# Altium project forwardConverterPCB.PrjPcb (part 17 of 22)
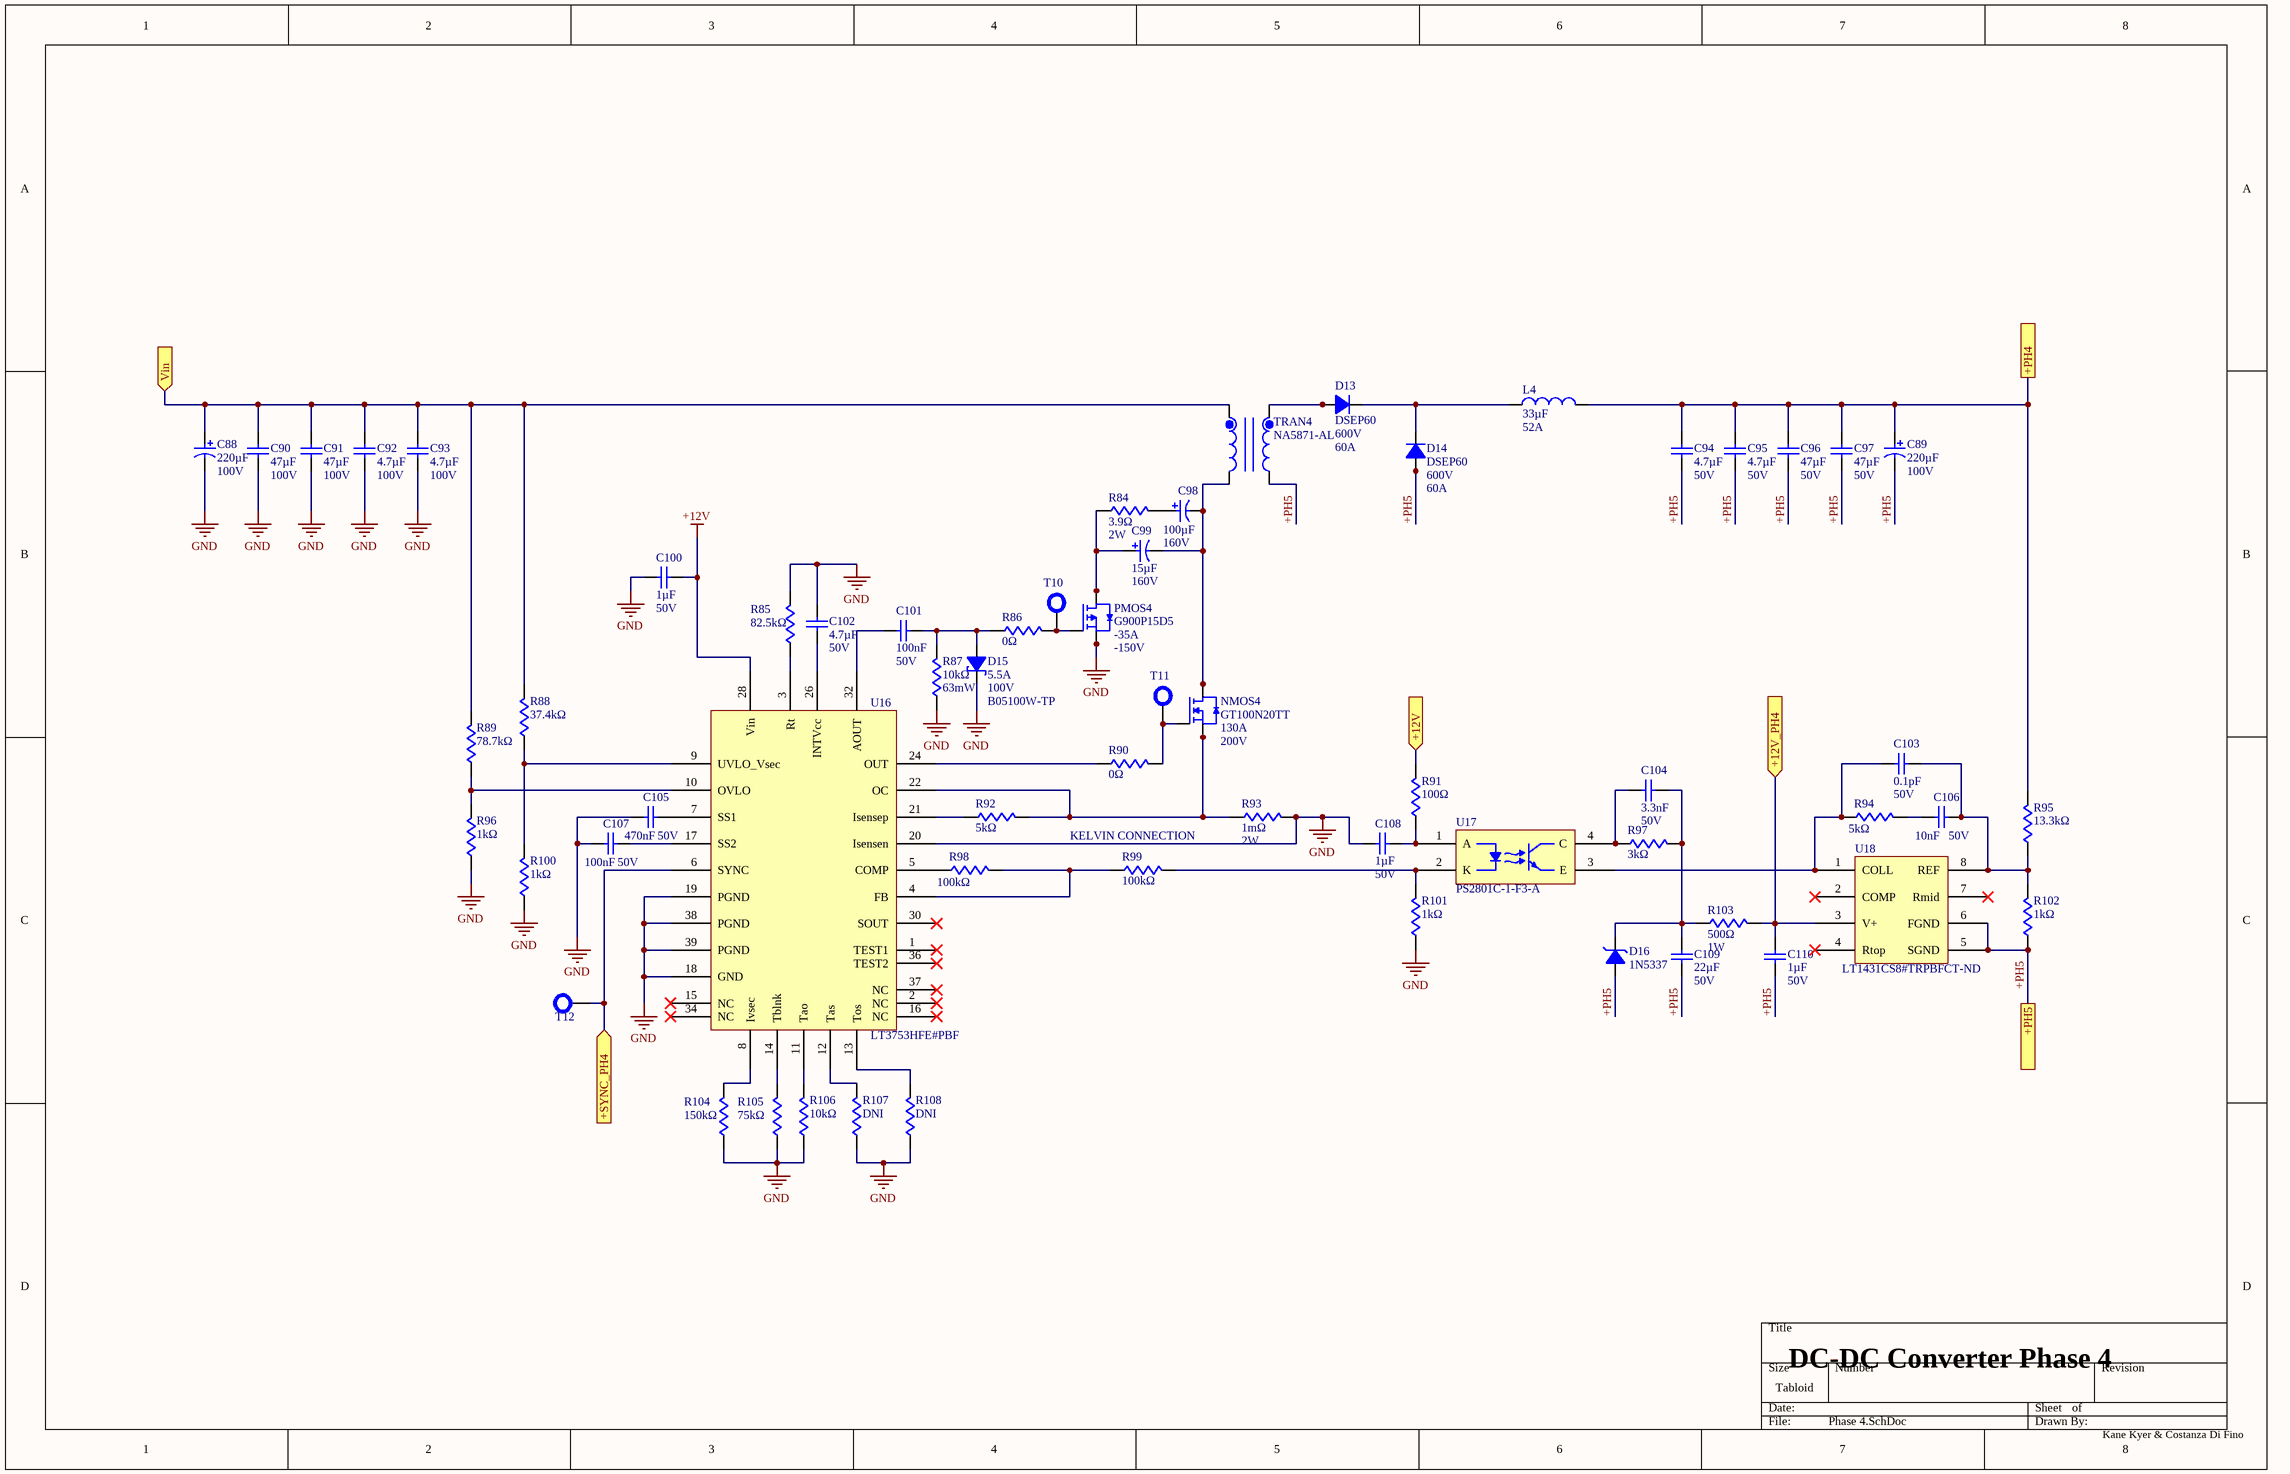
[diagram p22: Phase 4.SchDoc]

## Sheet Phase 4.SchDoc (continued)

### Library data of the parts (continued)
R89 = RC0603FR-0778K7L: Res Thick Film 0603 78.7K Ohm 1% 0.1W(1/10W) ±100ppm/C Pad SMD T/R; Manufacturer: Yageo Group; Power Dissipation: 100mW; Temperature Coefficient: 100ppm/°C; Voltage Rating: 75V; Voltage Rating (DC): 50V; Supplier: DigiKey; Supplier Part Number: 311-78.7KHRCT-ND; Manufacturer Part Number: RC0603FR-0778K7L; RoHS: Compliant; Category: Chip SMD Resistors; Stock: 146230; Pricing: 1=0.1, 10=0.009, 25=0.008, 50=0.0072, 100=0.0066, 250=0.00568 (USD); Case/Package: 0603; Case Code (Imperial): 0603; China RoHS: Non-Compliant; Composition: Thick Film; Country of Origin: Mainland China, Taiwan; Depth: 800µm; Export Control Classification Number (ECCN) Code: EAR99; Features: Moisture Resistant; Height: 450µm; Harmonized Tariff Schedule (HTS) Code: 8533.21.00.30; Introduction Date: 2004-09-22; Lead Free: Lead Free; Length: 1.6mm; Lifecycle Status: Production; Max Operating Temperature: 155°C; Military Standard: Not; Min Operating Temperature: -55°C; Mounting Technology: Surface Mount; Number of Terminals: 2; Number of Terminations: 2; Packaging: Tape & Reel; Power Rating: 100mW; REACH SVHC: Yes; Schedule B: 8533210045, 8533210045|8533210045|8533210045|8533210045|8533210045; Termination: SMD/SMT; Tolerance: 1%; Weight: 2.012816mg; Width: 800µm; Working Voltage: 75V; ComponentLink1URL: https://datasheet.octopart.com:443/RC0603FR-0778K7L-Yageo-datasheet-175887523.pdf?src-supplier=Newark; ComponentLink1Description: https://datasheet.octopart.com:443/RC0603FR-0778K7L-Yageo-datasheet-175887523.pdf?src-supplier=Newark; ComponentLink2URL: https://datasheet.octopart.com:443/RC0603FR-0778K7L-Yageo-datasheet-103092701.pdf?src-supplier=Upverter; ComponentLink2Description: https://datasheet.octopart.com:443/RC0603FR-0778K7L-Yageo-datasheet-103092701.pdf?src-supplier=Upverter; ComponentLink3URL: https://datasheet.octopart.com:443/RC0603FR-0778K7L-Yageo-datasheet-98239111.pdf?src-supplier=Upverter; ComponentLink3Description: https://datasheet.octopart.com:443/RC0603FR-0778K7L-Yageo-datasheet-98239111.pdf?src-supplier=Upverter; ComponentLink4URL: https://datasheet.octopart.com:443/RC0603FR-0778K7L-Yageo-Group-datasheet-176638170.pdf?src-supplier=Future+Electronics; ComponentLink4Description: https://datasheet.octopart.com:443/RC0603FR-0778K7L-Yageo-Group-datasheet-176638170.pdf?src-supplier=Future+Electronics; ComponentLink5URL: https://datasheet.octopart.com:443/RC0603FR-0778K7L-Yageo-datasheet-164759695.pdf?src-supplier=Future+Electronics; ComponentLink5Description: https://datasheet.octopart.com:443/RC0603FR-0778K7L-Yageo-datasheet-164759695.pdf?src-supplier=Future+Electronics; ComponentLink6URL: https://datasheet.octopart.com:443/RC0603FR-0778K7L-Yageo-datasheet-137700087.pdf?src-supplier=Future+Electronics; ComponentLink6Description: https://datasheet.octopart.com:443/RC0603FR-0778K7L-Yageo-datasheet-137700087.pdf?src-supplier=Future+Electronics; ComponentLink7URL: https://datasheet.octopart.com:443/RC0603FR-0778K7L-Yageo-datasheet-17842380.pdf?src-supplier=Future+Electronics; ComponentLink7Description: https://datasheet.octopart.com:443/RC0603FR-0778K7L-Yageo-datasheet-17842380.pdf?src-supplier=Future+Electronics; ComponentLink8URL: https://datasheet.octopart.com:443/RC0603FR-0778K7L-Yageo-datasheet-15599030.pdf?src-supplier=Future+Electronics; ComponentLink8Description: https://datasheet.octopart.com:443/RC0603FR-0778K7L-Yageo-datasheet-15599030.pdf?src-supplier=Future+Electronics; ComponentLink9URL: https://datasheet.octopart.com:443/RC0603FR-0778K7L-Yageo-datasheet-12596169.pdf?src-supplier=Future+Electronics; ComponentLink9Description: https://datasheet.octopart.com:443/RC0603FR-0778K7L-Yageo-datasheet-12596169.pdf?src-supplier=Future+Electronics; ComponentLink10URL: https://datasheet.octopart.com:443/RC0603FR-0778K7L-Yageo-datasheet-8328172.pdf?src-supplier=Future+Electronics; ComponentLink10Description: https://datasheet.octopart.com:443/RC0603FR-0778K7L-Yageo-datasheet-8328172.pdf?src-supplier=Future+Electronics; ComponentLink11URL: https://datasheet.octopart.com/RC0603FR-0778K7L-Yageo-datasheet-73766026.pdf; ComponentLink11Description: https://datasheet.octopart.com/RC0603FR-0778K7L-Yageo-datasheet-73766026.pdf; ComponentLink12URL: https://datasheet.octopart.com:443/RC0603FR-0778K7L-Yageo-datasheet-118562.pdf?src-supplier=DigiKey; ComponentLink12Description: https://datasheet.octopart.com:443/RC0603FR-0778K7L-Yageo-datasheet-118562.pdf?src-supplier=DigiKey; ComponentLink13URL: http://sigma.octopart.com:80/conflict_mineral_statement/Yageo-company-3.pdf?src-supplier=Compliance+Statements; ComponentLink13Description: http://sigma.octopart.com:80/conflict_mineral_statement/Yageo-company-3.pdf?src-supplier=Compliance+Statements; ComponentLink14URL: http://sigma.octopart.com:80/rohs_statement/Yageo-company-2.pdf?src-supplier=Compliance+Statements; ComponentLink14Description: http://sigma.octopart.com:80/rohs_statement/Yageo-company-2.pdf?src-supplier=Compliance+Statements; Max Power Dissipation: 100mW
R91 = RC0603FR-07100RL: Yageo RC0603FR-07100RL 0603 SMD Resistor 100 Ohm thin film chip resistor; Manufacturer: Yageo Group; Power Dissipation: 100mW; Temperature Coefficient: 100ppm/°C; Tolerance: 1%; Voltage Rating: 75V; Voltage Rating (DC): 50V; Supplier: DigiKey; Supplier Part Number: 311-100HRCT-ND; Manufacturer Part Number: RC0603FR-07100RL; RoHS: Compliant; Category: Chip SMD Resistors; Stock: 4571529; Pricing: 1=0.1, 10=0.008, 25=0.0068, 50=0.0052 (USD); Case/Package: 0603; Case Code (Imperial): 0603; Case Code (Metric): 0603; China RoHS: Non-Compliant; Composition: Thick Film; Depth: 800µm; Height: 450µm; Lead Free: Lead Free; Length: 1.6mm; Lifecycle Status: Production; Max Operating Temperature: 155°C; Military Standard: Not; Min Operating Temperature: -55°C; Mounting Technology: Surface Mount; Pins: 2; Number of Terminals: 2; Packaging: Cut Tape (CT); REACH SVHC: Yes; Schedule B: 8533210045, 8533210045|8533210045|8533210045|8533210045|8533210045|8533210045|8533210045|8533210045|8533210045|8533210045|8533210045|8533210045|8533210045|8533210045|8533210045|8533210045|8533210045|8533210045|8533210045|8533210045|8533210045|8533210045|8533210045|85; Termination: SMD/SMT; Width: 800µm; Working Voltage: 75V; ComponentLink1URL: https://datasheet.octopart.com:443/RC0603FR-07100RL-Yageo-datasheet-175887523.pdf?src-supplier=IHS; ComponentLink1Description: https://datasheet.octopart.com:443/RC0603FR-07100RL-Yageo-datasheet-175887523.pdf?src-supplier=IHS; ComponentLink2URL: https://datasheet.octopart.com:443/RC0603FR-07100RL-Yageo-datasheet-8328172.pdf?src-supplier=Newark; ComponentLink2Description: https://datasheet.octopart.com:443/RC0603FR-07100RL-Yageo-datasheet-8328172.pdf?src-supplier=Newark; ComponentLink3URL: https://datasheet.octopart.com:443/RC0603FR-07100RL-Yageo-datasheet-34211833.pdf?src-supplier=Newark; ComponentLink3Description: https://datasheet.octopart.com:443/RC0603FR-07100RL-Yageo-datasheet-34211833.pdf?src-supplier=Newark; ComponentLink4URL: https://datasheet.octopart.com:443/RC0603FR-07100RL-Yageo-datasheet-103092701.pdf?src-supplier=Upverter; ComponentLink4Description: https://datasheet.octopart.com:443/RC0603FR-07100RL-Yageo-datasheet-103092701.pdf?src-supplier=Upverter; ComponentLink5URL: https://datasheet.octopart.com:443/RC0603FR-07100RL-Yageo-datasheet-62067350.pdf?src-supplier=element14+APAC; ComponentLink5Description: https://datasheet.octopart.com:443/RC0603FR-07100RL-Yageo-datasheet-62067350.pdf?src-supplier=element14+APAC; ComponentLink6URL: https://datasheet.octopart.com:443/RC0603FR-07100RL-Yageo-datasheet-17842380.pdf?src-supplier=element14+APAC; ComponentLink6Description: https://datasheet.octopart.com:443/RC0603FR-07100RL-Yageo-datasheet-17842380.pdf?src-supplier=element14+APAC; ComponentLink7URL: https://datasheet.octopart.com:443/RC0603FR-07100RL-Yageo-datasheet-12596169.pdf?src-supplier=Future+Electronics; ComponentLink7Description: https://datasheet.octopart.com:443/RC0603FR-07100RL-Yageo-datasheet-12596169.pdf?src-supplier=Future+Electronics; ComponentLink8URL: https://datasheet.octopart.com:443/RC0603FR-07100RL-Yageo-Group-datasheet-176638170.pdf?src-supplier=Future+Electronics; ComponentLink8Description: https://datasheet.octopart.com:443/RC0603FR-07100RL-Yageo-Group-datasheet-176638170.pdf?src-supplier=Future+Electronics; ComponentLink9URL: https://datasheet.octopart.com:443/RC0603FR-07100RL-Yageo-datasheet-164759695.pdf?src-supplier=Future+Electronics; ComponentLink9Description: https://datasheet.octopart.com:443/RC0603FR-07100RL-Yageo-datasheet-164759695.pdf?src-supplier=Future+Electronics; ComponentLink10URL: https://datasheet.octopart.com:443/RC0603FR-07100RL-Yageo-datasheet-137700087.pdf?src-supplier=Future+Electronics; ComponentLink10Description: https://datasheet.octopart.com:443/RC0603FR-07100RL-Yageo-datasheet-137700087.pdf?src-supplier=Future+Electronics; ComponentLink11URL: https://datasheet.octopart.com:443/RC0603FR07100RL-Yageo-datasheet-27584510.pdf?src-supplier=Future+Electronics; ComponentLink11Description: https://datasheet.octopart.com:443/RC0603FR07100RL-Yageo-datasheet-27584510.pdf?src-supplier=Future+Electronics; ComponentLink12URL: https://datasheet.octopart.com:443/RC0603FR-07100RL-Yageo-datasheet-15599030.pdf?src-supplier=Future+Electronics; ComponentLink12Description: https://datasheet.octopart.com:443/RC0603FR-07100RL-Yageo-datasheet-15599030.pdf?src-supplier=Future+Electronics; ComponentLink13URL: https://datasheet.octopart.com:443/RC0603FR-07100RL-Yageo-datasheet-8324193.pdf?src-supplier=Future+Electronics; ComponentLink13Description: https://datasheet.octopart.com:443/RC0603FR-07100RL-Yageo-datasheet-8324193.pdf?src-supplier=Future+Electronics; ComponentLink14URL: https://datasheet.octopart.com:443/RC0603FR-07100RL-Yageo-datasheet-79472498.pdf?src-supplier=Megastar; ComponentLink14Description: https://datasheet.octopart.com:443/RC0603FR-07100RL-Yageo-datasheet-79472498.pdf?src-supplier=Megastar; ComponentLink15URL: https://datasheet.octopart.com/RC0603FR-07100RL-Yageo-datasheet-73766026.pdf; ComponentLink15Description: https://datasheet.octopart.com/RC0603FR-07100RL-Yageo-datasheet-73766026.pdf; ComponentLink16URL: https://datasheet.octopart.com:443/RC0603FR-07100RL-Yageo-datasheet-13691069.pdf?src-supplier=Farnell; ComponentLink16Description: https://datasheet.octopart.com:443/RC0603FR-07100RL-Yageo-datasheet-13691069.pdf?src-supplier=Farnell; ComponentLink17URL: https://datasheet.octopart.com:443/RC0603FR-07100RL-Yageo-datasheet-118562.pdf?src-supplier=DigiKey; ComponentLink17Description: https://datasheet.octopart.com:443/RC0603FR-07100RL-Yageo-datasheet-118562.pdf?src-supplier=DigiKey; ComponentLink18URL: http://sigma.octopart.com:80/conflict_mineral_statement/Yageo-company-3.pdf?src-supplier=Compliance+Statements; ComponentLink18Description: http://sigma.octopart.com:80/conflict_mineral_statement/Yageo-company-3.pdf?src-supplier=Compliance+Statements; ComponentLink19URL: http://sigma.octopart.com:80/rohs_statement/Yageo-company-2.pdf?src-supplier=Compliance+Statements; ComponentLink19Description: http://sigma.octopart.com:80/rohs_statement/Yageo-company-2.pdf?src-supplier=Compliance+Statements; Power Rating: 100mW
R92 R94 = PNM0402E5001BST1: Res Thin Film 0402 5K Ohm 0.1% 0.05W(1/20W) +/-25ppm/C Sulfur Resistant Pad SMD Medical T/R; Manufacturer: Vishay; Power Dissipation: 50mW; Temperature Coefficient: 25ppm/°C; Working Voltage: 75V; Supplier: DigiKey; Supplier Part Number: 541-1901-1-ND; Manufacturer Part Number: PNM0402E5001BST1; RoHS: Compliant; Category: Chip SMD Resistors; Stock: 20153; Pricing: 1=0.82, 10=0.684, 25=0.6344, 50=0.622 (USD); Case/Package: 0402; Case Code (Imperial): 0402; Case Code (Metric): 1005; Composition: Thin Film; Features: Anti-Sulfur, Moisture Resistant; Height: 838.2µm; Length: 1.0668mm; Lifecycle Status: Production; Max Operating Temperature: 155°C; Min Operating Temperature: -55°C; Mounting Technology: Surface Mount; Number of Terminals: 2; Number of Terminations: 2; Packaging: Tape & Reel (TR); REACH SVHC: Yes; Schedule B: 8533210045, 8533210045|8533210045|8533210045|8533210045|8533210045; Tolerance: 0.1%; Width: 558.8µm; ComponentLink1URL: https://datasheet.octopart.com:443/PNM0402E5001BST1-Vishay-datasheet-170667721.pdf?src-supplier=IHS; ComponentLink1Description: https://datasheet.octopart.com:443/PNM0402E5001BST1-Vishay-datasheet-170667721.pdf?src-supplier=IHS; ComponentLink2URL: https://datasheet.octopart.com:443/PNM0402E5001BST1-Vishay-datasheet-152765003.pdf?src-supplier=Future+Electronics; ComponentLink2Description: https://datasheet.octopart.com:443/PNM0402E5001BST1-Vishay-datasheet-152765003.pdf?src-supplier=Future+Electronics; ComponentLink3URL: https://datasheet.octopart.com:443/PNM0402E5001BST1-Vishay-datasheet-128669662.pdf?src-supplier=X-ON; ComponentLink3Description: https://datasheet.octopart.com:443/PNM0402E5001BST1-Vishay-datasheet-128669662.pdf?src-supplier=X-ON; ComponentLink4URL: http://sigma.octopart.com:80/rohs_statement/Vishay-company-15.pdf?src-supplier=Compliance+Statements; ComponentLink4Description: http://sigma.octopart.com:80/rohs_statement/Vishay-company-15.pdf?src-supplier=Compliance+Statements; Max Power Dissipation: 50mW
R93 = CRE2512-FZ-R001E-2: Res Thick Film 2512 1m Ohm 1% 2W ±75ppm/°C Molded SMD Embossed T/R; Manufacturer: Bourns; Temperature Coefficient: 50ppm/°C; Supplier: DigiKey; Supplier Part Number: CRE2512-FZ-R001E-2CT-ND; Manufacturer Part Number: CRE2512-FZ-R001E-2; RoHS: Compliant; Category: Chip SMD Resistors; Stock: 83654; Pricing: 1=0.67, 10=0.432, 25=0.368, 50=0.3276, 100=0.2933, 250=0.2556, 500=0.23198, 1000=0.21192 (USD); Case/Package: 2512; Case Code (Imperial): 2512; Case Code (Metric): 6432; China RoHS: Compliant; Composition: Metal Alloy, Metal Film, Thick Film; Contact Plating: Tin; Depth: 3.35mm; Export Control Classification Number (ECCN) Code: EAR99; Features: Automotive AEC-Q200, Moisture Resistant; Height: 700µm; Harmonized Tariff Schedule (HTS) Code: 8533.21.00.30; Introduction Date: 2014-06-25; Length: 6.4516mm; Lifecycle Status: Production; Max Operating Temperature: 170°C; Max Power Dissipation: 2W; Min Operating Temperature: -55°C; Mounting Technology: Surface Mount; Number of Terminals: 2; Number of Terminations: 2; Packaging: Cut Tape; Power Dissipation: 2W; REACH SVHC: Yes; Schedule B: 8533210045, 8533210045|8533210045, 8533210045|8533210045|8533210045, 8533210045|8533210045|8533210045|8533210045; Termination: Solder; Tolerance: 1%; Width: 3.2mm; ComponentLink1URL: https://datasheet.octopart.com:443/CRE2512-FZ-R001E-2-Bourns-datasheet-156155911.pdf?src-supplier=IHS; ComponentLink1Description: https://datasheet.octopart.com:443/CRE2512-FZ-R001E-2-Bourns-datasheet-156155911.pdf?src-supplier=IHS; ComponentLink2URL: https://datasheet.octopart.com:443/CRE2512-FZ-R001E-2-Bourns-datasheet-49270460.pdf?src-supplier=RS+(Formerly+Allied+Electronics); ComponentLink2Description: https://datasheet.octopart.com:443/CRE2512-FZ-R001E-2-Bourns-datasheet-49270460.pdf?src-supplier=RS+(Formerly+Allied+Electronics); ComponentLink3URL: https://datasheet.octopart.com:443/CRE2512-FZ-R001E-2-Bourns-datasheet-38225744.pdf?src-supplier=RS+(Formerly+Allied+Electronics); ComponentLink3Description: https://datasheet.octopart.com:443/CRE2512-FZ-R001E-2-Bourns-datasheet-38225744.pdf?src-supplier=RS+(Formerly+Allied+Electronics); ComponentLink4URL: https://datasheet.octopart.com:443/CRE2512-FZ-R001E-2-Bourns-datasheet-27832208.pdf?src-supplier=Newark; ComponentLink4Description: https://datasheet.octopart.com:443/CRE2512-FZ-R001E-2-Bourns-datasheet-27832208.pdf?src-supplier=Newark; ComponentLink5URL: https://datasheet.octopart.com:443/CRE2512-FZ-R001E-2-Bourns-datasheet-154729668.pdf?src-supplier=Electro+Sonic; ComponentLink5Description: https://datasheet.octopart.com:443/CRE2512-FZ-R001E-2-Bourns-datasheet-154729668.pdf?src-supplier=Electro+Sonic; ComponentLink6URL: https://datasheet.octopart.com:443/CRE2512-FZ-R001E-2-Bourns-datasheet-68301998.pdf?src-supplier=Burklin+Elektronik; ComponentLink6Description: https://datasheet.octopart.com:443/CRE2512-FZ-R001E-2-Bourns-datasheet-68301998.pdf?src-supplier=Burklin+Elektronik; ComponentLink7URL: http://sigma.octopart.com:80/conflict_mineral_statement/Bourns-company-36.pdf?src-supplier=Compliance+Statements; ComponentLink7Description: http://sigma.octopart.com:80/conflict_mineral_statement/Bourns-company-36.pdf?src-supplier=Compliance+Statements
R95 = RMCF0603FT13K3: Res Thick Film 0603 13.3K Ohm 1% 0.1W(1/10W) ±100ppm/C Pad SMD Automotive T/R; Manufacturer: Stackpole Electronics; Power Dissipation: 100mW; Temperature Coefficient: 100ppm/°C; Voltage Rating: 75V; Supplier: DigiKey; Supplier Part Number: RMCF0603FT13K3CT-ND; Manufacturer Part Number: RMCF0603FT13K3; RoHS: Compliant; Category: Chip SMD Resistors; Stock: 194115; Pricing: 1=0.1, 10=0.006, 25=0.0056, 50=0.0058, 100=0.0048 (USD); Case/Package: 0603; Case Code (Imperial): 0603; Case Code (Metric): 1608; China RoHS: Non-Compliant; Composition: Thick Film; Contact Plating: Tin; Country of Origin: Japan, Mainland China, Taiwan; Export Control Classification Number (ECCN) Code: EAR99; Features: Automotive AEC-Q200; Height: 450µm; Harmonized Tariff Schedule (HTS) Code: 8533.21.00.30; Introduction Date: 2011-01-07; Lead Free: Lead Free; Length: 1.5494mm; Lifecycle Status: Production; Max Operating Temperature: 155°C; Min Operating Temperature: -55°C; Mounting Technology: Surface Mount; Number of Terminals: 2; Number of Terminations: 2; Packaging: Cut Tape (CT); Power Rating: 100mW; Radiation Hardening: No; REACH SVHC: Yes; Schedule B: 8533210045, 8533210045|8533210045, 8533210045|8533210045|8533210045, 8533210045|8533210045|8533210045|8533210045; Tolerance: 1%; Width: 800µm; Working Voltage: 75V; ComponentLink1URL: https://datasheet.octopart.com:443/RMCF0603FT13K3-Stackpole-Electronics-datasheet-182148065.pdf?src-supplier=IHS; ComponentLink1Description: https://datasheet.octopart.com:443/RMCF0603FT13K3-Stackpole-Electronics-datasheet-182148065.pdf?src-supplier=IHS; ComponentLink2URL: https://datasheet.octopart.com:443/RMCF0603FT13K3-Stackpole-Electronics-datasheet-28504820.pdf?src-supplier=Upverter; ComponentLink2Description: https://datasheet.octopart.com:443/RMCF0603FT13K3-Stackpole-Electronics-datasheet-28504820.pdf?src-supplier=Upverter; ComponentLink3URL: https://datasheet.octopart.com:443/RMCF0603FT13K3-Stackpole-Electronics-datasheet-141193804.pdf?src-supplier=Master+Electronics; ComponentLink3Description: https://datasheet.octopart.com:443/RMCF0603FT13K3-Stackpole-Electronics-datasheet-141193804.pdf?src-supplier=Master+Electronics; ComponentLink4URL: https://datasheet.octopart.com:443/RMCF0603FT13K3-Stackpole-Electronics-datasheet-189104163.pdf?src-supplier=Master+Electronics; ComponentLink4Description: https://datasheet.octopart.com:443/RMCF0603FT13K3-Stackpole-Electronics-datasheet-189104163.pdf?src-supplier=Master+Electronics; ComponentLink5URL: https://datasheet.octopart.com:443/RMCF0603FT13K3-Stackpole-Electronics-datasheet-116606903.pdf?src-supplier=Master+Electronics; ComponentLink5Description: https://datasheet.octopart.com:443/RMCF0603FT13K3-Stackpole-Electronics-datasheet-116606903.pdf?src-supplier=Master+Electronics; ComponentLink6URL: https://datasheet.octopart.com:443/RMCF0603FT13K3-Stackpole-Electronics-datasheet-62091608.pdf?src-supplier=Stackpole+Electronics; ComponentLink6Description: https://datasheet.octopart.com:443/RMCF0603FT13K3-Stackpole-Electronics-datasheet-62091608.pdf?src-supplier=Stackpole+Electronics; ComponentLink7URL: https://datasheet.octopart.com:443/RMCF0603FT13K3-Stackpole-Electronics-datasheet-12534581.pdf?src-supplier=Stackpole+Electronics; ComponentLink7Description: https://datasheet.octopart.com:443/RMCF0603FT13K3-Stackpole-Electronics-datasheet-12534581.pdf?src-supplier=Stackpole+Electronics; ComponentLink8URL: https://datasheet.octopart.com:443/RMCF0603FT13K3-Stackpole-Electronics-datasheet-10788263.pdf?src-supplier=Stackpole+Electronics; ComponentLink8Description: https://datasheet.octopart.com:443/RMCF0603FT13K3-Stackpole-Electronics-datasheet-10788263.pdf?src-supplier=Stackpole+Electronics; ComponentLink9URL: https://datasheet.octopart.com:443/RMCF0603FT13K3-Stackpole-Electronics-datasheet-11546843.pdf?src-supplier=Arrow+Electronics; ComponentLink9Description: https://datasheet.octopart.com:443/RMCF0603FT13K3-Stackpole-Electronics-datasheet-11546843.pdf?src-supplier=Arrow+Electronics; ComponentLink10URL: http://sigma.octopart.com:80/15940719/materials_sheet/Stackpole-Electronics-RMCF0603FT13K3.pdf?src-supplier=Compliance+Statements; ComponentLink10Description: http://sigma.octopart.com:80/15940719/materials_sheet/Stackpole-Electronics-RMCF0603FT13K3.pdf?src-supplier=Compliance+Statements; ComponentLink11URL: http://sigma.octopart.com:80/141158211/reach_statement/Stackpole-Electronics-RMCF0603FT13K3.pdf?src-supplier=Compliance+Statements; ComponentLink11Description: http://sigma.octopart.com:80/141158211/reach_statement/Stackpole-Electronics-RMCF0603FT13K3.pdf?src-supplier=Compliance+Statements; ComponentLink12URL: http://sigma.octopart.com:80/141158212/rohs_statement/Stackpole-Electronics-RMCF0603FT13K3.pdf?src-supplier=Compliance+Statements; ComponentLink12Description: http://sigma.octopart.com:80/141158212/rohs_statement/Stackpole-Electronics-RMCF0603FT13K3.pdf?src-supplier=Compliance+Statements; Max Power Dissipation: 100mW
R96 R100-R102 = RM04F1001CT: 62.5mW Thick Film Resistors ±100ppm/℃ ±1% 1kΩ 0402 Chip Resistor - Surface Mount ROHS; Manufacturer: Cal-Chip Electronics; Temperature Coefficient: 100ppm/°C; Working Voltage: 50V; Supplier: DigiKey; Supplier Part Number: 4713-RM04F1001CT-ND; Manufacturer Part Number: RM04F1001CT; RoHS: Compliant; Category: Chip SMD Resistors; Stock: 97211; Pricing: 1=0.1, 10=0.015, 25=0.0108, 50=0.0086, 100=0.0068, 250=0.00512, 500=0.00418, 1000=0.00345, 5000=0.00232 (USD); China RoHS: Non-Compliant; Country of Origin: Slovenia, South Korea, Taiwan; Export Control Classification Number (ECCN) Code: EAR99; Height: 350µm; Harmonized Tariff Schedule (HTS) Code: 8533.21.00.30; Introduction Date: 1999-11-02; Length: 1mm; Lifecycle Status: Production; Max Operating Temperature: 155°C; Min Operating Temperature: -55°C; Mounting Technology: Surface Mount; Number of Terminals: 2; Power Dissipation: 62.5mW; REACH SVHC: Yes; Tolerance: 1%; Width: 500µm; ComponentLink1URL: https://datasheet.octopart.com:443/RM04F1001CT-Cal-Chip-Electronics-datasheet-182142084.pdf?src-supplier=IHS; ComponentLink1Description: https://datasheet.octopart.com:443/RM04F1001CT-Cal-Chip-Electronics-datasheet-182142084.pdf?src-supplier=IHS
R97 = AC0402FR-073KL: Res Thick Film 0402 3K Ohm 1% 0.063W(1/16W) ±100ppm/C Pad SMD Automotive T/R; Manufacturer: Yageo Group; Max Power Dissipation: 63mW; Power Dissipation: 62.5mW; Temperature Coefficient: 100ppm/°C; Voltage Rating: 50V; Supplier: DigiKey; Supplier Part Number: YAG3485CT-ND; Manufacturer Part Number: AC0402FR-073KL; RoHS: Compliant; Category: Chip SMD Resistors; Stock: 232444; Pricing: 1=0.1, 10=0.007, 25=0.006, 50=0.0052, 100=0.0046, 250=0.00408 (USD); Case/Package: 0402; Case Code (Imperial): 0402; Case Code (Metric): 1005; China RoHS: Non-Compliant; Composition: Thick Film; Features: Automotive AEC-Q200, Moisture Resistant; Height: 320µm; Lead Free: Lead Free; Length: 1mm; Lifecycle Status: Production; Max Operating Temperature: 155°C; Min Operating Temperature: -55°C; Mounting Technology: Surface Mount; Number of Terminals: 2; Number of Terminations: 2; Packaging: Tape & Reel; Power Rating: 63mW; REACH SVHC: Yes; Schedule B: 8533210045; Termination: SMD/SMT; Tolerance: 1%; Width: 500µm; Working Voltage: 50V; ComponentLink1URL: https://datasheet.octopart.com:443/AC0402FR-073KL-Yageo-datasheet-182189377.pdf?src-supplier=IHS; ComponentLink1Description: https://datasheet.octopart.com:443/AC0402FR-073KL-Yageo-datasheet-182189377.pdf?src-supplier=IHS; ComponentLink2URL: https://datasheet.octopart.com:443/AC0402FR-073KL-Yageo-datasheet-83209224.pdf?src-supplier=Upverter; ComponentLink2Description: https://datasheet.octopart.com:443/AC0402FR-073KL-Yageo-datasheet-83209224.pdf?src-supplier=Upverter; ComponentLink3URL: https://datasheet.octopart.com:443/AC0402FR-073KL-Yageo-datasheet-178509465.pdf?src-supplier=Newark; ComponentLink3Description: https://datasheet.octopart.com:443/AC0402FR-073KL-Yageo-datasheet-178509465.pdf?src-supplier=Newark; ComponentLink4URL: https://datasheet.octopart.com/AC0402FR-073KL-Yageo-datasheet-12512238.pdf; ComponentLink4Description: https://datasheet.octopart.com/AC0402FR-073KL-Yageo-datasheet-12512238.pdf; ComponentLink5URL: https://datasheet.octopart.com:443/AC0402FR-073KL-Yageo-Group-datasheet-189830439.pdf?src-supplier=Future+Electronics; ComponentLink5Description: https://datasheet.octopart.com:443/AC0402FR-073KL-Yageo-Group-datasheet-189830439.pdf?src-supplier=Future+Electronics; ComponentLink6URL: https://datasheet.octopart.com:443/AC0402FR-073KL-Yageo-datasheet-166720450.pdf?src-supplier=Future+Electronics; ComponentLink6Description: https://datasheet.octopart.com:443/AC0402FR-073KL-Yageo-datasheet-166720450.pdf?src-supplier=Future+Electronics; ComponentLink7URL: https://datasheet.octopart.com:443/AC0402FR-073KL-Yageo-datasheet-151884373.pdf?src-supplier=Future+Electronics; ComponentLink7Description: https://datasheet.octopart.com:443/AC0402FR-073KL-Yageo-datasheet-151884373.pdf?src-supplier=Future+Electronics; ComponentLink8URL: https://datasheet.octopart.com:443/AC0402FR-073KL-Yageo-datasheet-137699919.pdf?src-supplier=Future+Electronics; ComponentLink8Description: https://datasheet.octopart.com:443/AC0402FR-073KL-Yageo-datasheet-137699919.pdf?src-supplier=Future+Electronics; ComponentLink9URL: https://datasheet.octopart.com:443/AC0402FR-073KL-Yageo-datasheet-24580492.pdf?src-supplier=Future+Electronics; ComponentLink9Description: https://datasheet.octopart.com:443/AC0402FR-073KL-Yageo-datasheet-24580492.pdf?src-supplier=Future+Electronics; ComponentLink10URL: https://datasheet.octopart.com:443/AC0402FR-073KL-Yageo-datasheet-13029202.pdf?src-supplier=Future+Electronics; ComponentLink10Description: https://datasheet.octopart.com:443/AC0402FR-073KL-Yageo-datasheet-13029202.pdf?src-supplier=Future+Electronics; ComponentLink11URL: https://datasheet.octopart.com:443/AC0402FR-073KL-Yageo-Group-datasheet-188689268.pdf?src-supplier=TME; ComponentLink11Description: https://datasheet.octopart.com:443/AC0402FR-073KL-Yageo-Group-datasheet-188689268.pdf?src-supplier=TME; ComponentLink12URL: https://datasheet.octopart.com:443/AC0402FR-073KL-Yageo-Group-datasheet-164768995.pdf?src-supplier=ODG+(Origin+Data+Global); ComponentLink12Description: https://datasheet.octopart.com:443/AC0402FR-073KL-Yageo-Group-datasheet-164768995.pdf?src-supplier=ODG+(Origin+Data+Global); ComponentLink13URL: https://datasheet.octopart.com:443/AC0402FR-073KL-Yageo-datasheet-128678012.pdf?src-supplier=X-ON; ComponentLink13Description: https://datasheet.octopart.com:443/AC0402FR-073KL-Yageo-datasheet-128678012.pdf?src-supplier=X-ON; ComponentLink14URL: http://sigma.octopart.com:80/conflict_mineral_statement/Yageo-company-3.pdf?src-supplier=Compliance+Statements; ComponentLink14Description: http://sigma.octopart.com:80/conflict_mineral_statement/Yageo-company-3.pdf?src-supplier=Compliance+Statements; ComponentLink15URL: http://sigma.octopart.com:80/rohs_statement/Yageo-company-2.pdf?src-supplier=Compliance+Statements; ComponentLink15Description: http://sigma.octopart.com:80/rohs_statement/Yageo-company-2.pdf?src-supplier=Compliance+Statements
R98 R99 = RM04F1003CT: Fixed Resistor, Metal Glaze/thick Film, 0.0625W, 100000ohm, 50V, 1% +/-Tol, Surface Mount, 0402; Manufacturer: Cal-Chip Electronics; Power Dissipation: 62.5mW; Temperature Coefficient: 100ppm/°C; Supplier: DigiKey; Supplier Part Number: 4713-RM04F1003CT-ND; Manufacturer Part Number: RM04F1003CT; RoHS: Compliant; Category: Chip SMD Resistors; Stock: 54062; Pricing: 1=0.1, 10=0.016, 25=0.0112, 50=0.0088, 100=0.0071, 250=0.00532, 500=0.00434, 1000=0.0036, 5000=0.00243 (USD); China RoHS: Non-Compliant; Height: 350µm; Lifecycle Status: Production; Max Operating Temperature: 155°C; Min Operating Temperature: -55°C; Mounting Technology: Surface Mount; Number of Terminals: 2; REACH SVHC: Yes; Tolerance: 1%; Width: 500µm; Working Voltage: 50V; ComponentLink1URL: https://datasheet.octopart.com:443/RM04F1003CT-Cal-Chip-Electronics-datasheet-182142084.pdf?src-supplier=IHS; ComponentLink1Description: https://datasheet.octopart.com:443/RM04F1003CT-Cal-Chip-Electronics-datasheet-182142084.pdf?src-supplier=IHS
R103 = WSC2515500R0FEB: Fixed Resistor, Wire Wound, 1W, 500ohm, 22.3607V, 1% +/-Tol, 20ppm/Cel, Surface Mount, 2515; Manufacturer: Vishay; Temperature Coefficient: 20ppm/°C; Supplier Part Number: 541-WSC2515500R0FEBCT-ND; Manufacturer Part Number: WSC2515500R0FEB; RoHS: Compliant; Category: Chip SMD Resistors; Stock: 195; Pricing: 1=3, 10=2.005, 25=1.736, 50=1.5674, 100=1.4241, 250=1.26704, 500=1.16878 (USD); Case/Package: 2515; Case Code (Imperial): 2515; Case Code (Metric): 6438; China RoHS: Compliant; Composition: Wirewound; Contact Plating: Tin; Export Control Classification Number (ECCN) Code: EAR99; Height: 2.79mm; Harmonized Tariff Schedule (HTS) Code: 8533.21.00.80; Introduction Date: 2017-01-26; Lead Free: Lead Free; Length: 6.4mm; Lifecycle Status: Production; Max Operating Temperature: 275°C; Min Operating Temperature: -65°C; Mounting Technology: Surface Mount; Pins: 2515; Number of Terminals: 2; Power Dissipation: 1W; Radiation Hardening: No; REACH SVHC: Yes; Tolerance: 1%; Width: 3.81mm; Working Voltage: 22.3607V; ComponentLink1URL: https://datasheet.octopart.com:443/WSC2515500R0FEB-Vishay-datasheet-181963761.pdf?src-supplier=IHS; ComponentLink1Description: https://datasheet.octopart.com:443/WSC2515500R0FEB-Vishay-datasheet-181963761.pdf?src-supplier=IHS; ComponentLink2URL: https://datasheet.octopart.com:443/WSC2515500R0FEB-Vishay-datasheet-13246520.pdf?src-supplier=Future+Electronics; ComponentLink2Description: https://datasheet.octopart.com:443/WSC2515500R0FEB-Vishay-datasheet-13246520.pdf?src-supplier=Future+Electronics; ComponentLink3URL: https://datasheet.octopart.com:443/WSC2515500R0FEB-Vishay-datasheet-12546667.pdf?src-supplier=Future+Electronics; ComponentLink3Description: https://datasheet.octopart.com:443/WSC2515500R0FEB-Vishay-datasheet-12546667.pdf?src-supplier=Future+Electronics; ComponentLink4URL: https://datasheet.octopart.com:443/WSC2515500R0FEB-Vishay-datasheet-12536819.pdf?src-supplier=Future+Electronics; ComponentLink4Description: https://datasheet.octopart.com:443/WSC2515500R0FEB-Vishay-datasheet-12536819.pdf?src-supplier=Future+Electronics; ComponentLink5URL: https://datasheet.octopart.com:443/WSC2515500R0FEB-Vishay-datasheet-12524190.pdf?src-supplier=Future+Electronics; ComponentLink5Description: https://datasheet.octopart.com:443/WSC2515500R0FEB-Vishay-datasheet-12524190.pdf?src-supplier=Future+Electronics; ComponentLink6URL: https://datasheet.octopart.com:443/WSC2515500R0FEB-Vishay-datasheet-12510334.pdf?src-supplier=Future+Electronics; ComponentLink6Description: https://datasheet.octopart.com:443/WSC2515500R0FEB-Vishay-datasheet-12510334.pdf?src-supplier=Future+Electronics; ComponentLink7URL: https://datasheet.octopart.com:443/WSC2515500R0FEB-Vishay-datasheet-10288063.pdf?src-supplier=Future+Electronics; ComponentLink7Description: https://datasheet.octopart.com:443/WSC2515500R0FEB-Vishay-datasheet-10288063.pdf?src-supplier=Future+Electronics; ComponentLink8URL: https://datasheet.octopart.com:443/WSC2515500R0FEB-Vishay-datasheet-10186412.pdf?src-supplier=Future+Electronics; ComponentLink8Description: https://datasheet.octopart.com:443/WSC2515500R0FEB-Vishay-datasheet-10186412.pdf?src-supplier=Future+Electronics; ComponentLink9URL: https://datasheet.octopart.com:443/WSC2515500R0FEB-Vishay-datasheet-10047522.pdf?src-supplier=Future+Electronics; ComponentLink9Description: https://datasheet.octopart.com:443/WSC2515500R0FEB-Vishay-datasheet-10047522.pdf?src-supplier=Future+Electronics; ComponentLink10URL: https://datasheet.octopart.com:443/WSC2515500R0FEB-Vishay-datasheet-8858659.pdf?src-supplier=Future+Electronics; ComponentLink10Description: https://datasheet.octopart.com:443/WSC2515500R0FEB-Vishay-datasheet-8858659.pdf?src-supplier=Future+Electronics; ComponentLink11URL: https://datasheet.octopart.com:443/WSC2515500R0FEB-Vishay-datasheet-8447619.pdf?src-supplier=Future+Electronics; ComponentLink11Description: https://datasheet.octopart.com:443/WSC2515500R0FEB-Vishay-datasheet-8447619.pdf?src-supplier=Future+Electronics; ComponentLink12URL: https://datasheet.octopart.com:443/WSC2515500R0FEB-Vishay-datasheet-8359564.pdf?src-supplier=Future+Electronics; ComponentLink12Description: https://datasheet.octopart.com:443/WSC2515500R0FEB-Vishay-datasheet-8359564.pdf?src-supplier=Future+Electronics; ComponentLink13URL: https://datasheet.octopart.com:443/WSC2515500R0FEB-Vishay-datasheet-5314438.pdf?src-supplier=Future+Electronics; ComponentLink13Description: https://datasheet.octopart.com:443/WSC2515500R0FEB-Vishay-datasheet-5314438.pdf?src-supplier=Future+Electronics; ComponentLink14URL: http://sigma.octopart.com:80/rohs_statement/Vishay-company-15.pdf?src-supplier=Compliance+Statements; ComponentLink14Description: http://sigma.octopart.com:80/rohs_statement/Vishay-company-15.pdf?src-supplier=Compliance+Statements; Supplier: DigiKey
R104 = RC0603FR-07150KL: 100mW Thick Film Resistors 75V ±100ppm/℃ ±1% 150kΩ 0603 Chip Resistor - Surface Mount ROHS; Manufacturer: Yageo Group; Temperature Coefficient: 100ppm/°C; Voltage Rating (AC): 50V; Supplier Part Number: 311-150KHRCT-ND; Manufacturer Part Number: RC0603FR-07150KL; RoHS: Compliant; Category: Chip SMD Resistors; Stock: 340656; Pricing: 1=0.1, 10=0.007, 25=0.0068, 50=0.0062, 100=0.0057 (USD); Case/Package: 0603; Case Code (Imperial): 0603; China RoHS: Non-Compliant; Composition: Thick Film; Country of Origin: Mainland China, Taiwan; Depth: 800µm; Export Control Classification Number (ECCN) Code: EAR99; Features: Moisture Resistant; Height: 450µm; Harmonized Tariff Schedule (HTS) Code: 8533.21.00.30; Introduction Date: 2004-09-22; Lead Free: Lead Free; Length: 1.6mm; Lifecycle Status: Production; Max Operating Temperature: 155°C; Max Power Dissipation: 100mW; Military Standard: Not; Min Operating Temperature: -55°C; Mounting Technology: Surface Mount; Pins: 2; Number of Terminals: 2; Number of Terminations: 2; Packaging: Tape & Reel; Power Dissipation: 100mW; REACH SVHC: Yes; Schedule B: 8533210045, 8533210045|8533210045, 8533210045|8533210045|8533210045, 8533210045|8533210045|8533210045|8533210045; Termination: SMD/SMT; Tolerance: 1%; Voltage Rating: 75V; Voltage Rating (DC): 50V; Width: 800µm; Working Voltage: 75V; ComponentLink1URL: https://datasheet.octopart.com:443/RC0603FR-07150KL-Yageo-datasheet-175887523.pdf?src-supplier=Newark; ComponentLink1Description: https://datasheet.octopart.com:443/RC0603FR-07150KL-Yageo-datasheet-175887523.pdf?src-supplier=Newark; ComponentLink2URL: https://datasheet.octopart.com:443/RC0603FR-07150KL-Yageo-datasheet-12596169.pdf?src-supplier=Newark; ComponentLink2Description: https://datasheet.octopart.com:443/RC0603FR-07150KL-Yageo-datasheet-12596169.pdf?src-supplier=Newark; ComponentLink3URL: https://datasheet.octopart.com:443/RC0603FR-07150KL-Yageo-datasheet-34211833.pdf?src-supplier=Newark; ComponentLink3Description: https://datasheet.octopart.com:443/RC0603FR-07150KL-Yageo-datasheet-34211833.pdf?src-supplier=Newark; ComponentLink4URL: https://datasheet.octopart.com:443/RC0603FR-07150KL-Yageo-datasheet-62067350.pdf?src-supplier=Farnell; ComponentLink4Description: https://datasheet.octopart.com:443/RC0603FR-07150KL-Yageo-datasheet-62067350.pdf?src-supplier=Farnell; ComponentLink5URL: https://datasheet.octopart.com:443/RC0603FR-07150KL-Yageo-datasheet-13691069.pdf?src-supplier=Farnell; ComponentLink5Description: https://datasheet.octopart.com:443/RC0603FR-07150KL-Yageo-datasheet-13691069.pdf?src-supplier=Farnell; ComponentLink6URL: https://datasheet.octopart.com:443/RC0603FR-07150KL-Yageo-datasheet-164759695.pdf?src-supplier=Upverter; ComponentLink6Description: https://datasheet.octopart.com:443/RC0603FR-07150KL-Yageo-datasheet-164759695.pdf?src-supplier=Upverter; ComponentLink7URL: https://datasheet.octopart.com:443/RC0603FR-07150KL-Yageo-datasheet-103092701.pdf?src-supplier=Upverter; ComponentLink7Description: https://datasheet.octopart.com:443/RC0603FR-07150KL-Yageo-datasheet-103092701.pdf?src-supplier=Upverter; ComponentLink8URL: https://datasheet.octopart.com:443/RC0603FR-07150KL-Yageo-datasheet-98239111.pdf?src-supplier=Upverter; ComponentLink8Description: https://datasheet.octopart.com:443/RC0603FR-07150KL-Yageo-datasheet-98239111.pdf?src-supplier=Upverter; ComponentLink9URL: https://datasheet.octopart.com:443/RC0603FR-07150KL-Yageo-datasheet-8328172.pdf?src-supplier=element14+APAC; ComponentLink9Description: https://datasheet.octopart.com:443/RC0603FR-07150KL-Yageo-datasheet-8328172.pdf?src-supplier=element14+APAC; ComponentLink10URL: https://datasheet.octopart.com:443/RC0603FR-07150KL-Yageo-Group-datasheet-176638170.pdf?src-supplier=Future+Electronics; ComponentLink10Description: https://datasheet.octopart.com:443/RC0603FR-07150KL-Yageo-Group-datasheet-176638170.pdf?src-supplier=Future+Electronics; ComponentLink11URL: https://datasheet.octopart.com:443/RC0603FR-07150KL-Yageo-datasheet-137700087.pdf?src-supplier=Future+Electronics; ComponentLink11Description: https://datasheet.octopart.com:443/RC0603FR-07150KL-Yageo-datasheet-137700087.pdf?src-supplier=Future+Electronics; ComponentLink12URL: https://datasheet.octopart.com:443/RC0603FR-07150KL-Yageo-datasheet-27584510.pdf?src-supplier=Future+Electronics; ComponentLink12Description: https://datasheet.octopart.com:443/RC0603FR-07150KL-Yageo-datasheet-27584510.pdf?src-supplier=Future+Electronics; ComponentLink13URL: https://datasheet.octopart.com:443/RC0603FR-07150KL-Yageo-datasheet-15599030.pdf?src-supplier=Future+Electronics; ComponentLink13Description: https://datasheet.octopart.com:443/RC0603FR-07150KL-Yageo-datasheet-15599030.pdf?src-supplier=Future+Electronics; ComponentLink14URL: https://datasheet.octopart.com:443/RC0603FR-07150KL-Yageo-datasheet-8324193.pdf?src-supplier=Future+Electronics; ComponentLink14Description: https://datasheet.octopart.com:443/RC0603FR-07150KL-Yageo-datasheet-8324193.pdf?src-supplier=Future+Electronics; ComponentLink15URL: https://datasheet.octopart.com:443/RC0603FR-07150KL-Yageo-datasheet-148775077.pdf?src-supplier=TME; ComponentLink15Description: https://datasheet.octopart.com:443/RC0603FR-07150KL-Yageo-datasheet-148775077.pdf?src-supplier=TME; ComponentLink16URL: https://datasheet.octopart.com/RC0603FR-07150KL-Yageo-datasheet-73766026.pdf; ComponentLink16Description: https://datasheet.octopart.com/RC0603FR-07150KL-Yageo-datasheet-73766026.pdf; ComponentLink17URL: https://datasheet.octopart.com:443/RC0603FR-07150KL-Yageo-datasheet-30459151.pdf?src-supplier=Seeed+Studio; ComponentLink17Description: https://datasheet.octopart.com:443/RC0603FR-07150KL-Yageo-datasheet-30459151.pdf?src-supplier=Seeed+Studio; ComponentLink18URL: https://datasheet.octopart.com:443/RC0603FR-07150KL-Yageo-datasheet-118562.pdf?src-supplier=DigiKey; ComponentLink18Description: https://datasheet.octopart.com:443/RC0603FR-07150KL-Yageo-datasheet-118562.pdf?src-supplier=DigiKey; ComponentLink19URL: http://sigma.octopart.com:80/conflict_mineral_statement/Yageo-company-3.pdf?src-supplier=Compliance+Statements; ComponentLink19Description: http://sigma.octopart.com:80/conflict_mineral_statement/Yageo-company-3.pdf?src-supplier=Compliance+Statements; ComponentLink20URL: http://sigma.octopart.com:80/rohs_statement/Yageo-company-2.pdf?src-supplier=Compliance+Statements; ComponentLink20Description: http://sigma.octopart.com:80/rohs_statement/Yageo-company-2.pdf?src-supplier=Compliance+Statements; Supplier: DigiKey; Power Rating: 100mW
R105 = AC0603FR-0775KL: Res Thick Film 0603 75K Ohm 1% 0.1W(1/10W) ±100ppm/C Pad SMD T/R Automotive AEC-Q200; Manufacturer: Yageo Group; Max Power Dissipation: 100mW; Temperature Coefficient: 100ppm/°C; Voltage Rating: 75V; Supplier: DigiKey; Supplier Part Number: YAG3629CT-ND; Manufacturer Part Number: AC0603FR-0775KL; RoHS: Compliant; Category: Chip SMD Resistors; Stock: 229696; Pricing: 1=0.1, 10=0.007, 25=0.0068, 5000=0.00225 (USD); Case/Package: 0603; Case Code (Imperial): 0603; Case Code (Metric): 1608; China RoHS: Non-Compliant; Composition: Thick Film; Country of Origin: Mainland China, Taiwan; Depth: 800µm; Export Control Classification Number (ECCN) Code: EAR99; Features: Automotive AEC-Q200, Moisture Resistant; Height: 450µm; Harmonized Tariff Schedule (HTS) Code: 8533.21.00.30; Introduction Date: 2012-04-10; Lead Free: Lead Free; Length: 1.6mm; Lifecycle Status: Production; Max Operating Temperature: 155°C; Military Standard: Not; Min Operating Temperature: -55°C; Mounting Technology: Surface Mount; Number of Terminals: 2; Number of Terminations: 2; Power Dissipation: 100mW; REACH SVHC: Yes; Schedule B: 8533210045, 8533210045|8533210045, 8533210045|8533210045|8533210045, 8533210045|8533210045|8533210045|8533210045; Termination: SMD/SMT; Tolerance: 1%; Width: 800µm; Working Voltage: 75V; ComponentLink1URL: https://datasheet.octopart.com:443/AC0603FR-0775KL-Yageo-datasheet-182189377.pdf?src-supplier=IHS; ComponentLink1Description: https://datasheet.octopart.com:443/AC0603FR-0775KL-Yageo-datasheet-182189377.pdf?src-supplier=IHS; ComponentLink2URL: https://datasheet.octopart.com:443/AC0603FR-0775KL-Yageo-datasheet-86786639.pdf?src-supplier=Upverter; ComponentLink2Description: https://datasheet.octopart.com:443/AC0603FR-0775KL-Yageo-datasheet-86786639.pdf?src-supplier=Upverter; ComponentLink3URL: https://datasheet.octopart.com:443/AC0603FR-0775KL-Yageo-datasheet-178509465.pdf?src-supplier=Newark; ComponentLink3Description: https://datasheet.octopart.com:443/AC0603FR-0775KL-Yageo-datasheet-178509465.pdf?src-supplier=Newark; ComponentLink4URL: https://datasheet.octopart.com/AC0603FR-0775KL-Yageo-datasheet-12512238.pdf; ComponentLink4Description: https://datasheet.octopart.com/AC0603FR-0775KL-Yageo-datasheet-12512238.pdf; ComponentLink5URL: https://datasheet.octopart.com:443/AC0603FR-0775KL-Yageo-Group-datasheet-189830439.pdf?src-supplier=Future+Electronics; ComponentLink5Description: https://datasheet.octopart.com:443/AC0603FR-0775KL-Yageo-Group-datasheet-189830439.pdf?src-supplier=Future+Electronics; ComponentLink6URL: https://datasheet.octopart.com:443/AC0603FR-0775KL-Yageo-datasheet-166720450.pdf?src-supplier=Future+Electronics; ComponentLink6Description: https://datasheet.octopart.com:443/AC0603FR-0775KL-Yageo-datasheet-166720450.pdf?src-supplier=Future+Electronics; ComponentLink7URL: https://datasheet.octopart.com:443/AC0603FR-0775KL-Yageo-datasheet-151884373.pdf?src-supplier=Future+Electronics; ComponentLink7Description: https://datasheet.octopart.com:443/AC0603FR-0775KL-Yageo-datasheet-151884373.pdf?src-supplier=Future+Electronics; ComponentLink8URL: https://datasheet.octopart.com:443/AC0603FR-0775KL-Yageo-datasheet-137699919.pdf?src-supplier=Future+Electronics; ComponentLink8Description: https://datasheet.octopart.com:443/AC0603FR-0775KL-Yageo-datasheet-137699919.pdf?src-supplier=Future+Electronics; ComponentLink9URL: https://datasheet.octopart.com:443/AC0603FR-0775KL-Yageo-datasheet-83209224.pdf?src-supplier=Future+Electronics; ComponentLink9Description: https://datasheet.octopart.com:443/AC0603FR-0775KL-Yageo-datasheet-83209224.pdf?src-supplier=Future+Electronics; ComponentLink10URL: https://datasheet.octopart.com:443/AC0603FR-0775KL-Yageo-datasheet-140571090.pdf?src-supplier=Arrow.cn; ComponentLink10Description: https://datasheet.octopart.com:443/AC0603FR-0775KL-Yageo-datasheet-140571090.pdf?src-supplier=Arrow.cn; ComponentLink11URL: http://sigma.octopart.com:80/conflict_mineral_statement/Yageo-company-3.pdf?src-supplier=Compliance+Statements; ComponentLink11Description: http://sigma.octopart.com:80/conflict_mineral_statement/Yageo-company-3.pdf?src-supplier=Compliance+Statements; ComponentLink12URL: http://sigma.octopart.com:80/rohs_statement/Yageo-company-2.pdf?src-supplier=Compliance+Statements; ComponentLink12Description: http://sigma.octopart.com:80/rohs_statement/Yageo-company-2.pdf?src-supplier=Compliance+Statements; Power Rating: 100mW
R106 = RM04F1002CT: Fixed Resistor, Metal Glaze/thick Film, 0.0625W, 10000ohm, 50V, 1% +/-Tol, Surface Mount, 0402; Manufacturer: Cal-Chip Electronics; Power Dissipation: 62.5mW; Power Rating: 63mW; Temperature Coefficient: 100ppm/°C; Supplier: DigiKey; Supplier Part Number: 4713-RM04F1002CT-ND; Manufacturer Part Number: RM04F1002CT; RoHS: Compliant; Category: Chip SMD Resistors; Stock: 357132; Pricing: 1=0.1, 10=0.015, 25=0.0108, 50=0.0086, 100=0.0068, 250=0.00512, 500=0.00418, 1000=0.00345, 5000=0.00232 (USD); Case/Package: 0402; China RoHS: Non-Compliant; Composition: Thick Film; Country of Origin: Slovenia, South Korea, Taiwan; Export Control Classification Number (ECCN) Code: EAR99; Height: 350µm; Harmonized Tariff Schedule (HTS) Code: 8533.21.00.30; Introduction Date: 1999-11-02; Lifecycle Status: Production; Max Operating Temperature: 155°C; Min Operating Temperature: -55°C; Mounting Technology: Surface Mount; Number of Terminals: 2; REACH SVHC: Yes; Tolerance: 1%; Voltage Rating: 50V; Width: 500µm; Working Voltage: 50V; ComponentLink1URL: https://datasheet.octopart.com:443/RM04F1002CT-Cal-Chip-Electronics-datasheet-182142084.pdf?src-supplier=IHS; ComponentLink1Description: https://datasheet.octopart.com:443/RM04F1002CT-Cal-Chip-Electronics-datasheet-182142084.pdf?src-supplier=IHS; ComponentLink2URL: https://datasheet.octopart.com:443/RM04F1002CT-Cal-Chip-Electronics-datasheet-159083027.pdf?src-supplier=Upverter; ComponentLink2Description: https://datasheet.octopart.com:443/RM04F1002CT-Cal-Chip-Electronics-datasheet-159083027.pdf?src-supplier=Upverter
TRAN4 = NA5871-AL: Transformer, planar, for TI UCC28950, SMT, RoHS; Manufacturer: Coilcraft; Max Supply Voltage: 60V; Min Input Voltage: 38V; Power Rating: 800W; Supplier: Coilcraft Direct; Manufacturer Part Number: NA5871-AL; RoHS: Compliant; Category: Inductors; Stock: 140; Pricing: 1=21.85, 100=20.92 (USD); Height: 13.5mm; Length: 48.5mm; Lifecycle Status: Production; Max Operating Temperature: 120°C; Min Operating Temperature: -40°C; Mounting Technology: Surface Mount; REACH SVHC: Yes; Width: 32.8mm; ComponentLink1URL: https://datasheet.octopart.com:443/NA5871-AL-Coilcraft-datasheet-180119798.pdf?src-supplier=IHS; ComponentLink1Description: https://datasheet.octopart.com:443/NA5871-AL-Coilcraft-datasheet-180119798.pdf?src-supplier=IHS; ComponentLink2URL: https://datasheet.octopart.com:443/NA5871-AL-Coilcraft-datasheet-94978006.pdf?src-supplier=Coilcraft+Direct; ComponentLink2Description: https://datasheet.octopart.com:443/NA5871-AL-Coilcraft-datasheet-94978006.pdf?src-supplier=Coilcraft+Direct; Supplier Part Number: NA5871-AL